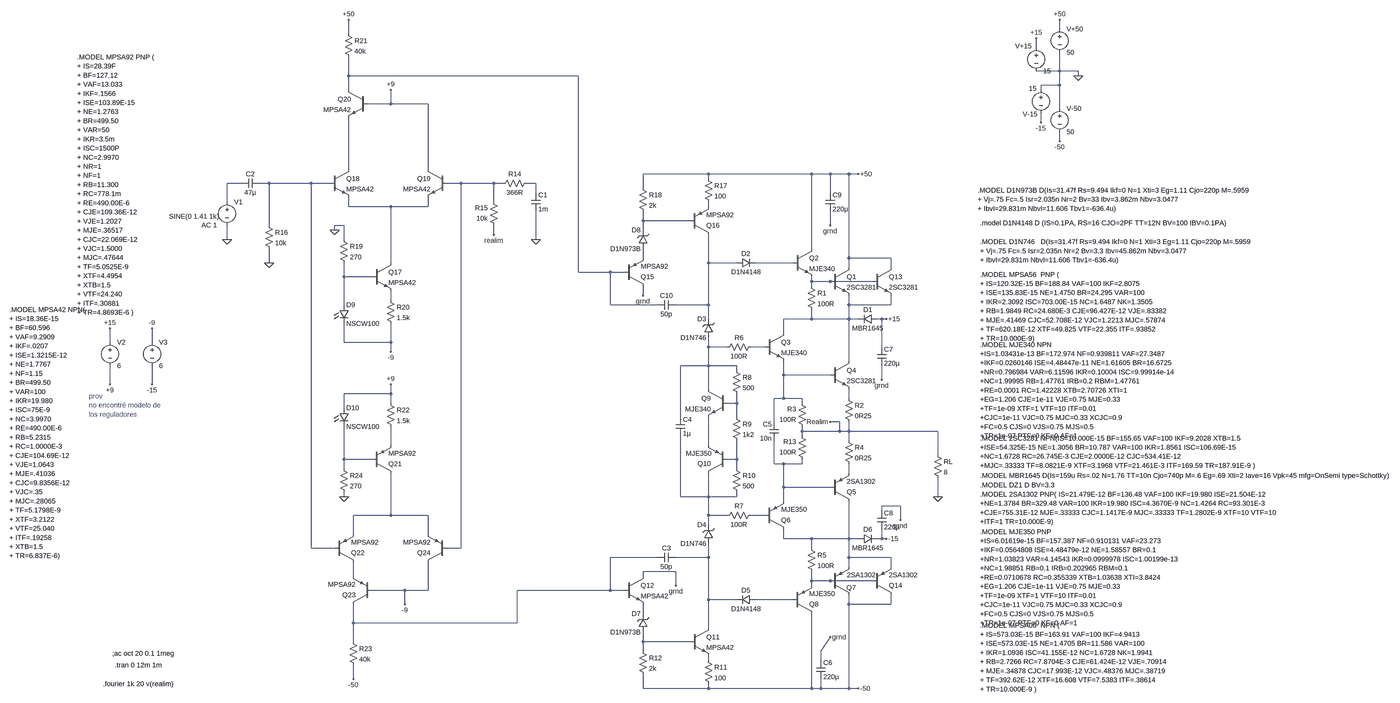
[diagram p0: schematic ampli_cascode_sinSS.asc, whole sheet]
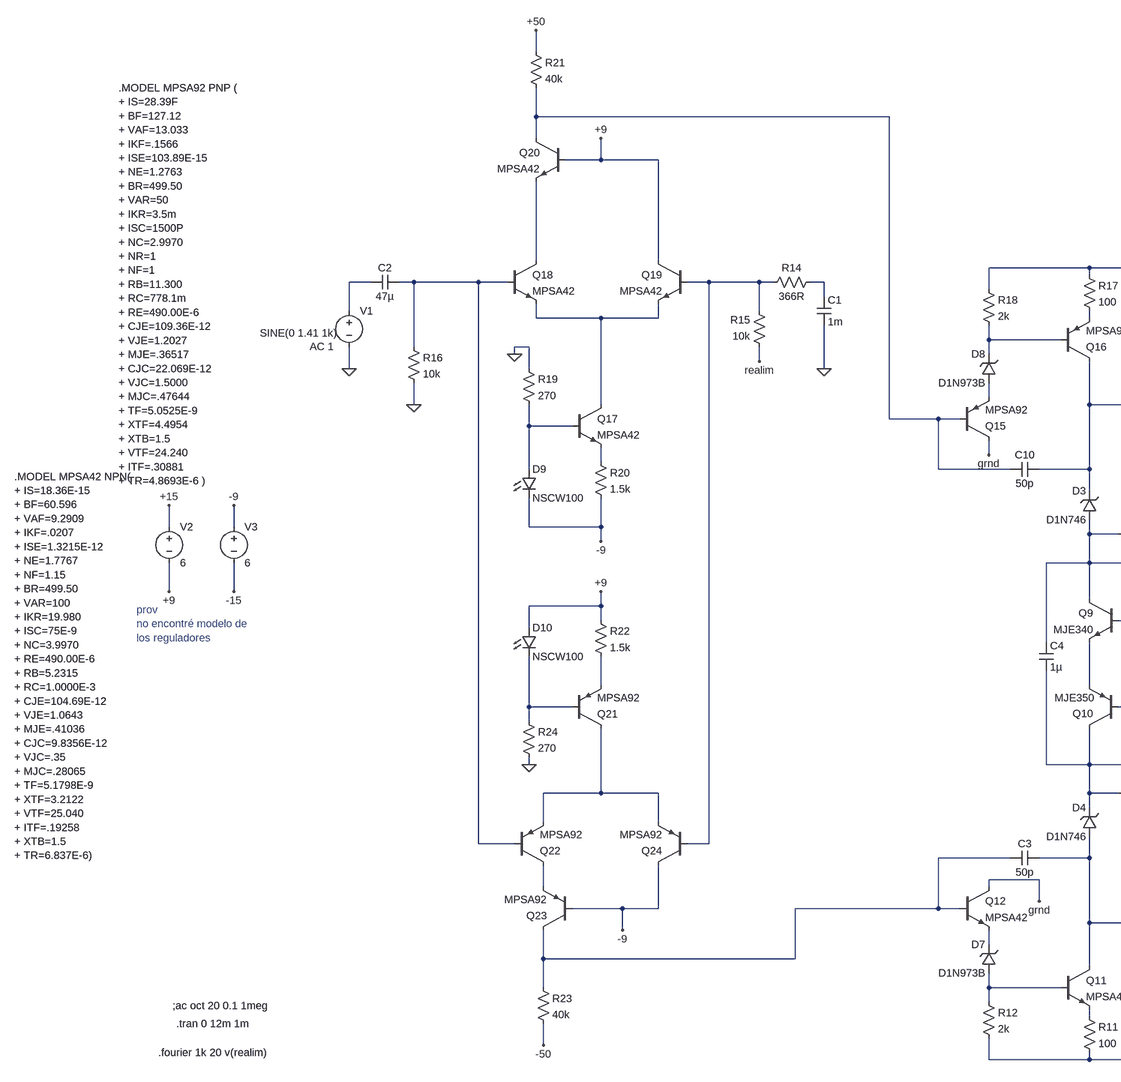
[diagram p1: schematic ampli_cascode_sinSS.asc, part, row 1 of 1, column 1 of 2]
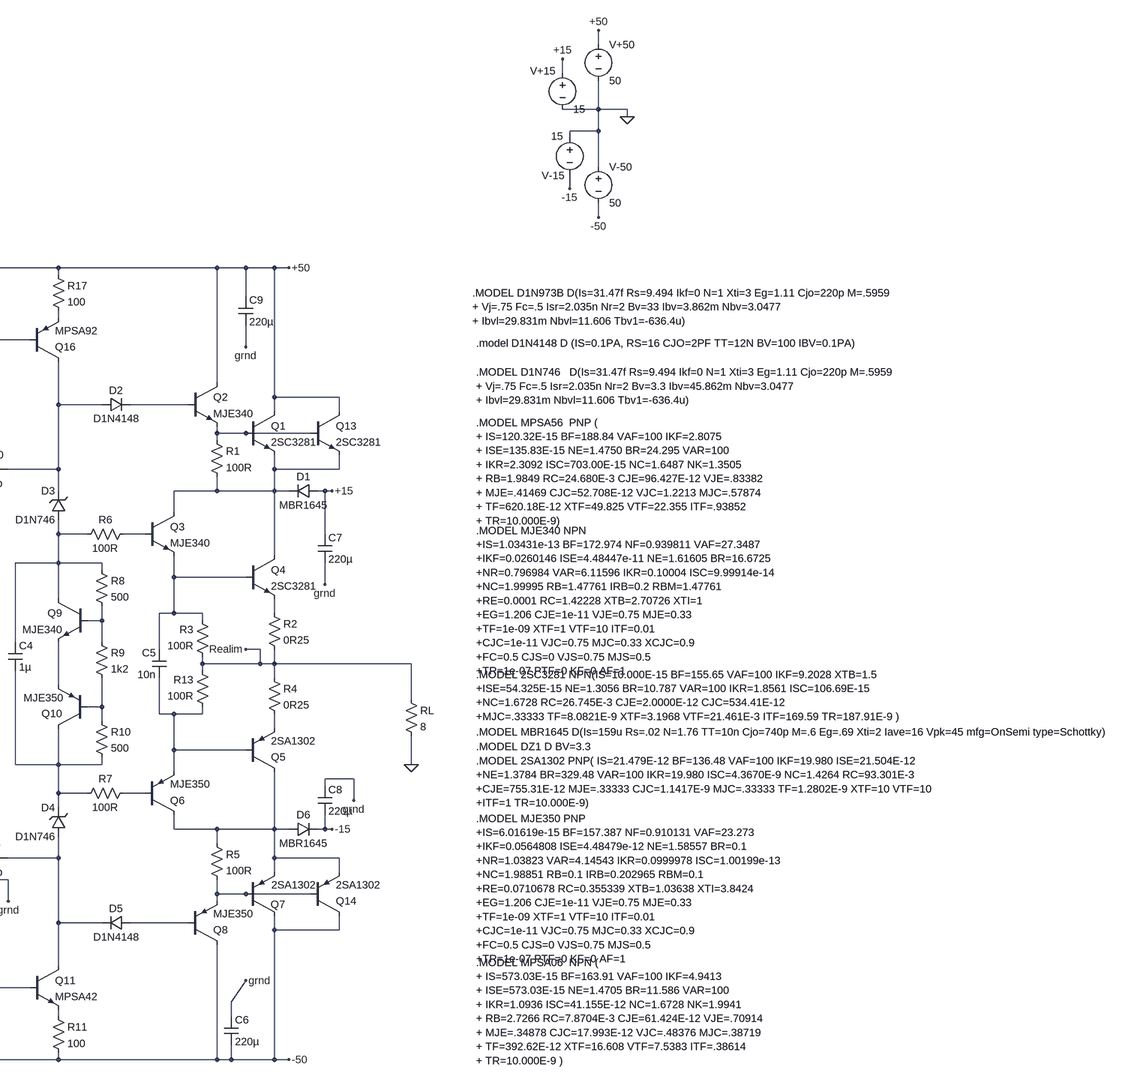
[diagram p2: schematic ampli_cascode_sinSS.asc, part, row 1 of 1, column 2 of 2]
ampli_cascode_sinSS.asc, the LTspice schematic file:
Version 4
SHEET 1 2432 4516
WIRE -576 -176 -576 -208
WIRE -3088 -160 -3088 -208
WIRE -656 -112 -656 -144
WIRE -576 -32 -576 -96
WIRE -576 -32 -656 -32
WIRE -512 -32 -576 -32
WIRE -3088 -16 -3088 -80
WIRE -2240 -16 -3088 -16
WIRE -512 -16 -512 -32
WIRE -576 16 -576 -32
WIRE -576 16 -640 16
WIRE -3088 32 -3088 -16
WIRE -640 32 -640 16
WIRE -2944 80 -2944 32
WIRE -2944 80 -3024 80
WIRE -2816 80 -2944 80
WIRE -576 96 -576 16
WIRE -640 144 -640 112
WIRE -576 208 -576 176
WIRE -3088 304 -3088 128
WIRE -2816 304 -2816 80
WIRE -1776 320 -2000 320
WIRE -1424 320 -1776 320
WIRE -1360 320 -1424 320
WIRE -1296 320 -1360 320
WIRE -1264 320 -1296 320
WIRE -1776 336 -1776 320
WIRE -3456 352 -3504 352
WIRE -3360 352 -3392 352
WIRE -3216 352 -3360 352
WIRE -3152 352 -3216 352
WIRE -2704 352 -2752 352
WIRE -2592 352 -2704 352
WIRE -2560 352 -2592 352
WIRE -2448 352 -2480 352
WIRE -2000 368 -2000 320
WIRE -2448 384 -2448 352
WIRE -1360 384 -1360 320
WIRE -3504 416 -3504 352
WIRE -2592 416 -2592 352
WIRE -3088 432 -3088 400
WIRE -2944 432 -3088 432
WIRE -2816 432 -2816 400
WIRE -2816 432 -2944 432
WIRE -1776 432 -1776 416
WIRE -2000 480 -2000 448
WIRE -1840 480 -2000 480
WIRE -3360 496 -3360 352
WIRE -3104 496 -3136 496
WIRE -1360 496 -1360 448
WIRE -3136 512 -3136 496
WIRE -2000 512 -2000 480
WIRE -2592 528 -2592 496
WIRE -3504 544 -3504 496
WIRE -3104 544 -3104 496
WIRE -2448 544 -2448 448
WIRE -1424 576 -1424 320
WIRE -2000 608 -2000 576
WIRE -1296 608 -1296 320
WIRE -1152 608 -1296 608
WIRE -3360 624 -3360 576
WIRE -2944 624 -2944 432
WIRE -1776 624 -1776 528
WIRE -1680 624 -1776 624
WIRE -1488 624 -1616 624
WIRE -1296 640 -1296 608
WIRE -1152 640 -1152 608
WIRE -2240 656 -2240 -16
WIRE -2112 656 -2240 656
WIRE -2064 656 -2112 656
WIRE -3104 672 -3104 624
WIRE -3008 672 -3104 672
WIRE -1424 688 -1424 672
WIRE -1360 688 -1424 688
WIRE -1216 688 -1360 688
WIRE -1424 704 -1424 688
WIRE -2000 736 -2000 704
WIRE -2944 752 -2944 720
WIRE -3104 768 -3104 672
WIRE -2112 768 -2112 656
WIRE -1952 768 -2112 768
WIRE -1776 768 -1776 624
WIRE -1776 768 -1888 768
WIRE -1296 768 -1296 736
WIRE -1152 768 -1152 736
WIRE -1152 768 -1296 768
WIRE -1776 816 -1776 768
WIRE -1424 816 -1424 784
WIRE -1424 816 -1520 816
WIRE -1296 816 -1296 768
WIRE -1296 816 -1424 816
WIRE -1264 816 -1296 816
WIRE -1184 816 -1200 816
WIRE -1168 816 -1184 816
WIRE -1520 864 -1520 816
WIRE -3904 896 -3904 848
WIRE -3760 896 -3760 848
WIRE -3104 896 -3104 832
WIRE -2944 896 -2944 832
WIRE -2944 896 -3104 896
WIRE -1776 912 -1776 880
WIRE -1712 912 -1776 912
WIRE -1584 912 -1632 912
WIRE -1184 912 -1184 816
WIRE -2944 928 -2944 896
WIRE -1296 960 -1296 816
WIRE -1776 976 -1776 912
WIRE -1776 976 -1872 976
WIRE -1680 976 -1776 976
WIRE -1680 992 -1680 976
WIRE -1520 1008 -1520 960
WIRE -1360 1008 -1520 1008
WIRE -1184 1024 -1184 976
WIRE -3904 1040 -3904 976
WIRE -3760 1040 -3760 976
WIRE -1776 1056 -1776 976
WIRE -2944 1072 -2944 1040
WIRE -2944 1072 -3104 1072
WIRE -1520 1088 -1520 1008
WIRE -1520 1088 -1552 1088
WIRE -1456 1088 -1520 1088
WIRE -1296 1088 -1296 1056
WIRE -2944 1104 -2944 1072
WIRE -1680 1104 -1680 1072
WIRE -1680 1104 -1712 1104
WIRE -1456 1104 -1456 1088
WIRE -3104 1120 -3104 1072
WIRE -1872 1152 -1872 976
WIRE -1680 1152 -1680 1104
WIRE -1552 1168 -1552 1088
WIRE -1328 1168 -1360 1168
WIRE -1456 1200 -1456 1184
WIRE -1328 1200 -1328 1168
WIRE -1328 1200 -1456 1200
WIRE -1296 1200 -1296 1168
WIRE -1296 1200 -1328 1200
WIRE -992 1200 -1296 1200
WIRE -1456 1216 -1456 1200
WIRE -1296 1232 -1296 1200
WIRE -2944 1248 -2944 1184
WIRE -1776 1248 -1776 1152
WIRE -992 1280 -992 1200
WIRE -3104 1296 -3104 1184
WIRE -3008 1296 -3104 1296
WIRE -1680 1296 -1680 1232
WIRE -1680 1296 -1712 1296
WIRE -1552 1312 -1552 1232
WIRE -1520 1312 -1552 1312
WIRE -1456 1312 -1456 1296
WIRE -1456 1312 -1520 1312
WIRE -3104 1328 -3104 1296
WIRE -1680 1328 -1680 1296
WIRE -1296 1344 -1296 1312
WIRE -1520 1392 -1520 1312
WIRE -1360 1392 -1520 1392
WIRE -3104 1424 -3104 1408
WIRE -1872 1424 -1872 1216
WIRE -1776 1424 -1776 1344
WIRE -1776 1424 -1872 1424
WIRE -1680 1424 -1680 1408
WIRE -1680 1424 -1776 1424
WIRE -992 1424 -992 1360
WIRE -1520 1440 -1520 1392
WIRE -1120 1456 -1184 1456
WIRE -1184 1472 -1184 1456
WIRE -2944 1488 -2944 1344
WIRE -2944 1488 -3072 1488
WIRE -2816 1488 -2944 1488
WIRE -1776 1488 -1776 1424
WIRE -1712 1488 -1776 1488
WIRE -1584 1488 -1632 1488
WIRE -1120 1504 -1120 1456
WIRE -1776 1520 -1776 1488
WIRE -3072 1552 -3072 1488
WIRE -2816 1552 -2816 1488
WIRE -1520 1568 -1520 1536
WIRE -1424 1568 -1520 1568
WIRE -1296 1568 -1296 1440
WIRE -1296 1568 -1424 1568
WIRE -1264 1568 -1296 1568
WIRE -1184 1568 -1184 1536
WIRE -1184 1568 -1200 1568
WIRE -1168 1568 -1184 1568
WIRE -3216 1600 -3216 352
WIRE -3136 1600 -3216 1600
WIRE -2704 1600 -2704 352
WIRE -2704 1600 -2752 1600
WIRE -1424 1600 -1424 1568
WIRE -1952 1632 -2112 1632
WIRE -1776 1632 -1776 1584
WIRE -1776 1632 -1888 1632
WIRE -1296 1632 -1296 1568
WIRE -1152 1632 -1296 1632
WIRE -1296 1664 -1296 1632
WIRE -1152 1664 -1152 1632
WIRE -1888 1680 -2000 1680
WIRE -3072 1696 -3072 1648
WIRE -2000 1696 -2000 1680
WIRE -1424 1712 -1424 1680
WIRE -1360 1712 -1424 1712
WIRE -1216 1712 -1360 1712
WIRE -1888 1728 -1888 1680
WIRE -1424 1728 -1424 1712
WIRE -2896 1744 -3008 1744
WIRE -2816 1744 -2816 1648
WIRE -2816 1744 -2896 1744
WIRE -2112 1744 -2112 1632
WIRE -2112 1744 -2512 1744
WIRE -2064 1744 -2112 1744
WIRE -1776 1776 -1776 1632
WIRE -1680 1776 -1776 1776
WIRE -1488 1776 -1616 1776
WIRE -2896 1792 -2896 1744
WIRE -1296 1792 -1296 1760
WIRE -1152 1792 -1152 1760
WIRE -1152 1792 -1296 1792
WIRE -2000 1824 -2000 1792
WIRE -3072 1856 -3072 1792
WIRE -2512 1856 -2512 1744
WIRE -2512 1856 -3072 1856
WIRE -1776 1872 -1776 1776
WIRE -3072 1920 -3072 1856
WIRE -2000 1920 -2000 1888
WIRE -1840 1920 -2000 1920
WIRE -2000 1952 -2000 1920
WIRE -1392 1952 -1360 1904
WIRE -1776 1984 -1776 1968
WIRE -1392 1984 -1392 1952
WIRE -3072 2048 -3072 2000
WIRE -2000 2080 -2000 2032
WIRE -1776 2080 -1776 2064
WIRE -1776 2080 -2000 2080
WIRE -1424 2080 -1424 1824
WIRE -1424 2080 -1776 2080
WIRE -1392 2080 -1392 2048
WIRE -1392 2080 -1424 2080
WIRE -1296 2080 -1296 1792
WIRE -1296 2080 -1392 2080
WIRE -1264 2080 -1296 2080
FLAG -512 -16 0
FLAG -576 -208 +50
FLAG -656 -144 +15
FLAG -640 144 -15
FLAG -576 208 -50
FLAG -1264 2080 -50
FLAG -1168 1568 -15
FLAG -1264 320 +50
FLAG -1168 816 +15
FLAG -2592 528 realim
FLAG -1360 1168 Realim
FLAG -1120 1504 grnd
FLAG -1184 1024 grnd
FLAG -1360 496 grnd
FLAG -1360 1904 grnd
FLAG -2000 736 grnd
FLAG -1888 1728 grnd
FLAG -3904 1040 +9
FLAG -3904 848 +15
FLAG -3760 848 -9
FLAG -3760 1040 -15
FLAG -2944 32 +9
FLAG -2944 928 -9
FLAG -3088 -208 +50
FLAG -2944 1040 +9
FLAG -2896 1792 -9
FLAG -3072 2048 -50
FLAG -3104 1424 0
FLAG -3136 512 0
FLAG -3360 624 0
FLAG -2448 544 0
FLAG -3504 544 0
FLAG -992 1424 0
SYMBOL rui\\shortcuts\\voltage -640 16 R0
WINDOW 0 -62 99 Left 2
WINDOW 3 -41 12 Left 2
WINDOW 123 0 0 Left 2
WINDOW 39 0 0 Left 2
SYMATTR InstName V-15
SYMATTR Value 15
SYMBOL rui\\shortcuts\\voltage -576 -192 R0
SYMATTR InstName V+50
SYMATTR Value 50
SYMBOL rui\\shortcuts\\voltage -656 -128 R0
WINDOW 0 -72 11 Left 2
SYMATTR InstName V+15
SYMATTR Value 15
SYMBOL rui\\shortcuts\\voltage -3504 400 R0
WINDOW 3 -198 65 Left 2
WINDOW 123 -87 95 Left 2
WINDOW 39 0 0 Left 2
SYMATTR Value SINE(0 1.41 1k)
SYMATTR Value2 AC 1
SYMATTR InstName V1
SYMBOL rui\\shortcuts\\voltage -576 80 R0
SYMATTR InstName V-50
SYMATTR Value 50
SYMBOL npn -1360 640 R0
SYMATTR InstName Q1
SYMATTR Value 2SC3281
SYMBOL npn -1488 576 R0
SYMATTR InstName Q2
SYMATTR Value MJE340
SYMBOL res -1440 688 R0
SYMATTR InstName R1
SYMATTR Value 100R
SYMBOL diode -1200 832 M270
WINDOW 0 32 32 VTop 2
WINDOW 3 0 32 VBottom 2
SYMATTR InstName D1
SYMATTR Value MBR1645
SYMBOL diode -1680 640 R270
WINDOW 0 32 32 VTop 2
WINDOW 3 0 32 VBottom 2
SYMATTR InstName D2
SYMATTR Value D1N4148
SYMBOL zener -1760 880 R180
WINDOW 0 24 64 Left 2
WINDOW 3 24 0 Left 2
SYMATTR InstName D3
SYMATTR Value D1N746
SYMBOL npn -1584 864 R0
SYMATTR InstName Q3
SYMATTR Value MJE340
SYMBOL npn -1360 960 R0
SYMATTR InstName Q4
SYMATTR Value 2SC3281
SYMBOL res -1312 1072 R0
SYMATTR InstName R2
SYMATTR Value 0R25
SYMBOL res -1440 1200 R180
WINDOW 0 36 76 Left 2
WINDOW 3 36 40 Left 2
SYMATTR InstName R3
SYMATTR Value 100R
SYMBOL res -1312 1216 R0
SYMATTR InstName R4
SYMATTR Value 0R25
SYMBOL pnp -1360 1440 M180
SYMATTR InstName Q5
SYMATTR Value 2SA1302
SYMBOL pnp -1584 1536 M180
SYMATTR InstName Q6
SYMATTR Value MJE350
SYMBOL pnp -1360 1760 M180
WINDOW 0 55 25 Left 2
WINDOW 3 57 68 Left 2
SYMATTR InstName Q7
SYMATTR Value 2SA1302
SYMBOL pnp -1488 1824 M180
SYMATTR InstName Q8
SYMATTR Value MJE350
SYMBOL res -1440 1584 R0
SYMATTR InstName R5
SYMATTR Value 100R
SYMBOL zener -1760 1584 R180
WINDOW 0 24 64 Left 2
WINDOW 3 24 0 Left 2
SYMATTR InstName D4
SYMATTR Value D1N746
SYMBOL diode -1616 1760 R90
WINDOW 0 0 32 VBottom 2
WINDOW 3 32 32 VTop 2
SYMATTR InstName D5
SYMATTR Value D1N4148
SYMBOL diode -1264 1584 R270
WINDOW 0 32 32 VTop 2
WINDOW 3 0 32 VBottom 2
SYMATTR InstName D6
SYMATTR Value MBR1645
SYMBOL res -1616 896 R90
WINDOW 0 0 56 VBottom 2
WINDOW 3 32 56 VTop 2
SYMATTR InstName R6
SYMATTR Value 100R
SYMBOL res -1616 1472 R90
WINDOW 0 0 56 VBottom 2
WINDOW 3 32 56 VTop 2
SYMATTR InstName R7
SYMATTR Value 100R
SYMBOL npn -1712 1056 M0
SYMATTR InstName Q9
SYMATTR Value MJE340
SYMBOL pnp -1712 1344 R180
WINDOW 0 56 33 Left 2
WINDOW 3 53 68 Left 2
SYMATTR InstName Q10
SYMATTR Value MJE350
SYMBOL res -1696 976 R0
SYMATTR InstName R8
SYMATTR Value 500
SYMBOL res -1696 1136 R0
SYMATTR InstName R9
SYMATTR Value 1k2
SYMBOL res -1696 1312 R0
SYMATTR InstName R10
SYMATTR Value 500
SYMBOL npn -1840 1872 R0
SYMATTR InstName Q11
SYMATTR Value MPSA42
SYMBOL res -1792 1968 R0
SYMATTR InstName R11
SYMATTR Value 100
SYMBOL npn -2064 1696 R0
SYMATTR InstName Q12
SYMATTR Value MPSA42
SYMBOL res -2016 1936 R0
SYMATTR InstName R12
SYMATTR Value 2k
SYMBOL res -1440 1312 R180
WINDOW 0 36 76 Left 2
WINDOW 3 36 40 Left 2
SYMATTR InstName R13
SYMATTR Value 100R
SYMBOL res -2576 368 R270
WINDOW 0 32 56 VTop 2
WINDOW 3 0 56 VBottom 2
SYMATTR InstName R14
SYMATTR Value 366R
SYMBOL res -2576 512 R180
WINDOW 0 36 76 Left 2
WINDOW 3 36 40 Left 2
SYMATTR InstName R15
SYMATTR Value 10k
SYMBOL res -3376 480 R0
SYMATTR InstName R16
SYMATTR Value 10k
SYMBOL cap -2464 384 R0
SYMATTR InstName C1
SYMATTR Value 1m
SYMBOL cap -3392 336 R90
WINDOW 0 0 32 VBottom 2
WINDOW 3 32 32 VTop 2
SYMATTR InstName C2
SYMATTR Value 47µ
SYMBOL cap -1888 1616 R90
WINDOW 0 0 32 VBottom 2
WINDOW 3 32 32 VTop 2
SYMATTR InstName C3
SYMATTR Value 50p
SYMBOL cap -1888 1152 R0
SYMATTR InstName C4
SYMATTR Value 1µ
SYMBOL cap -1536 1232 R180
WINDOW 0 24 56 Left 2
WINDOW 3 24 8 Left 2
SYMATTR InstName C5
SYMATTR Value 10n
SYMBOL npn -1216 640 R0
SYMATTR InstName Q13
SYMATTR Value 2SC3281
SYMBOL pnp -1216 1760 M180
SYMATTR InstName Q14
SYMATTR Value 2SA1302
SYMBOL cap -1408 1984 R0
SYMATTR InstName C6
SYMATTR Value 220µ
SYMBOL cap -1200 912 R0
SYMATTR InstName C7
SYMATTR Value 220µ
SYMBOL cap -1200 1472 R0
SYMATTR InstName C8
SYMATTR Value 220µ
SYMBOL cap -1376 384 R0
SYMATTR InstName C9
SYMATTR Value 220µ
SYMBOL pnp -2064 704 M180
SYMATTR InstName Q15
SYMATTR Value MPSA92
SYMBOL pnp -1840 528 M180
SYMATTR InstName Q16
SYMATTR Value MPSA92
SYMBOL cap -1888 752 R90
WINDOW 0 0 32 VBottom 2
WINDOW 3 32 32 VTop 2
SYMATTR InstName C10
SYMATTR Value 50p
SYMBOL res -1792 320 R0
SYMATTR InstName R17
SYMATTR Value 100
SYMBOL res -2016 352 R0
SYMATTR InstName R18
SYMATTR Value 2k
SYMBOL zener -1984 1888 R180
WINDOW 0 24 64 Left 2
WINDOW 3 24 0 Left 2
SYMATTR InstName D7
SYMATTR Value D1N973B
SYMBOL zener -1984 576 R180
WINDOW 0 24 64 Left 2
WINDOW 3 24 0 Left 2
SYMATTR InstName D8
SYMATTR Value D1N973B
SYMBOL rui\\shortcuts\\voltage -3904 880 R0
WINDOW 123 0 0 Left 2
WINDOW 39 0 0 Left 2
SYMATTR InstName V2
SYMATTR Value 6
SYMBOL rui\\shortcuts\\voltage -3760 880 R0
WINDOW 123 0 0 Left 2
WINDOW 39 0 0 Left 2
SYMATTR InstName V3
SYMATTR Value 6
SYMBOL npn -3008 624 R0
SYMATTR InstName Q17
SYMATTR Value MPSA42
SYMBOL npn -3152 304 R0
SYMATTR InstName Q18
SYMATTR Value MPSA42
SYMBOL npn -2752 304 M0
SYMATTR InstName Q19
SYMATTR Value MPSA42
SYMBOL res -3120 528 R0
SYMATTR InstName R19
SYMATTR Value 270
SYMBOL res -2960 736 R0
SYMATTR InstName R20
SYMATTR Value 1.5k
SYMBOL LED -3120 768 R0
SYMATTR InstName D9
SYMATTR Value NSCW100
SYMBOL res -3104 -176 R0
SYMATTR InstName R21
SYMATTR Value 40k
SYMBOL npn -3024 32 M0
SYMATTR InstName Q20
SYMATTR Value MPSA42
SYMBOL res -2960 1088 R0
SYMATTR InstName R22
SYMATTR Value 1.5k
SYMBOL rui\\shortcuts\\pnp -3008 1344 M180
SYMATTR InstName Q21
SYMATTR Value MPSA92
SYMBOL rui\\shortcuts\\pnp -3136 1648 M180
SYMATTR InstName Q22
SYMATTR Value MPSA92
SYMBOL rui\\shortcuts\\pnp -3008 1792 R180
SYMATTR InstName Q23
SYMATTR Value MPSA92
SYMBOL res -3088 1904 R0
SYMATTR InstName R23
SYMATTR Value 40k
SYMBOL rui\\shortcuts\\pnp -2752 1648 R180
SYMATTR InstName Q24
SYMATTR Value MPSA92
SYMBOL LED -3120 1120 R0
SYMATTR InstName D10
SYMATTR Value NSCW100
SYMBOL res -3120 1312 R0
SYMATTR InstName R24
SYMATTR Value 270
SYMBOL res -1008 1264 R0
SYMATTR InstName RL
SYMATTR Value 8
TEXT -3888 2000 Left 2 !.tran 0 12m 1m
TEXT -3976 1080 Left 2 ;prov\nno encontré modelo de\nlos reguladores
TEXT -4016 -80 Left 2 !.MODEL MPSA92 PNP (\n+ IS=28.39F\n+ BF=127.12\n+ VAF=13.033\n+ IKF=.1566\n+ ISE=103.89E-15\n+ NE=1.2763\n+ BR=499.50\n+ VAR=50\n+ IKR=3.5m\n+ ISC=1500P\n+ NC=2.9970\n+ NR=1\n+ NF=1\n+ RB=11.300\n+ RC=778.1m\n+ RE=490.00E-6\n+ CJE=109.36E-12\n+ VJE=1.2027\n+ MJE=.36517\n+ CJC=22.069E-12\n+ VJC=1.5000\n+ MJC=.47644\n+ TF=5.0525E-9\n+ XTF=4.4954\n+ XTB=1.5\n+ VTF=24.240\n+ ITF=.30881\n+ TR=4.8693E-6 )
TEXT -4248 784 Left 2 !.MODEL MPSA42 NPN(\n+ IS=18.36E-15\n+ BF=60.596\n+ VAF=9.2909\n+ IKF=.0207\n+ ISE=1.3215E-12\n+ NE=1.7767\n+ NF=1.15\n+ BR=499.50\n+ VAR=100\n+ IKR=19.980\n+ ISC=75E-9\n+ NC=3.9970\n+ RE=490.00E-6\n+ RB=5.2315\n+ RC=1.0000E-3\n+ CJE=104.69E-12\n+ VJE=1.0643\n+ MJE=.41036\n+ CJC=9.8356E-12\n+ VJC=.35\n+ MJC=.28065\n+ TF=5.1798E-9\n+ XTF=3.2122\n+ VTF=25.040\n+ ITF=.19258\n+ XTB=1.5\n+ TR=6.837E-6)
TEXT -3896 1960 Left 2 !;ac oct 20 0.1 1meg
TEXT -848 1384 Left 2 !.MODEL DZ1 D BV=3.3
TEXT -848 664 Left 2 !.MODEL MPSA56  PNP (\n+ IS=120.32E-15 BF=188.84 VAF=100 IKF=2.8075\n+ ISE=135.83E-15 NE=1.4750 BR=24.295 VAR=100\n+ IKR=2.3092 ISC=703.00E-15 NC=1.6487 NK=1.3505\n+ RB=1.9849 RC=24.680E-3 CJE=96.427E-12 VJE=.83382\n+ MJE=.41469 CJC=52.708E-12 VJC=1.2213 MJC=.57874\n+ TF=620.18E-12 XTF=49.825 VTF=22.355 ITF=.93852\n+ TR=10.000E-9)
TEXT -848 904 Left 2 !.MODEL MJE340 NPN\n+IS=1.03431e-13 BF=172.974 NF=0.939811 VAF=27.3487\n+IKF=0.0260146 ISE=4.48447e-11 NE=1.61605 BR=16.6725\n+NR=0.796984 VAR=6.11596 IKR=0.10004 ISC=9.99914e-14\n+NC=1.99995 RB=1.47761 IRB=0.2 RBM=1.47761\n+RE=0.0001 RC=1.42228 XTB=2.70726 XTI=1\n+EG=1.206 CJE=1e-11 VJE=0.75 MJE=0.33\n+TF=1e-09 XTF=1 VTF=10 ITF=0.01\n+CJC=1e-11 VJC=0.75 MJC=0.33 XCJC=0.9\n+FC=0.5 CJS=0 VJS=0.75 MJS=0.5\n+TR=1e-07 PTF=0 KF=0 AF=1
TEXT -848 1224 Left 2 !.MODEL 2SC3281 NPN(IS=10.000E-15 BF=155.65 VAF=100 IKF=9.2028 XTB=1.5\n+ISE=54.325E-15 NE=1.3056 BR=10.787 VAR=100 IKR=1.8561 ISC=106.69E-15\n+NC=1.6728 RC=26.745E-3 CJE=2.0000E-12 CJC=534.41E-12\n+MJC=.33333 TF=8.0821E-9 XTF=3.1968 VTF=21.461E-3 ITF=169.59 TR=187.91E-9 )
TEXT -848 1352 Left 2 !.MODEL MBR1645 D(Is=159u Rs=.02 N=1.76 TT=10n Cjo=740p M=.6 Eg=.69 Xti=2 Iave=16 Vpk=45 mfg=OnSemi type=Schottky)
TEXT -848 1416 Left 2 !.MODEL 2SA1302 PNP( IS=21.479E-12 BF=136.48 VAF=100 IKF=19.980 ISE=21.504E-12\n+NE=1.3784 BR=329.48 VAR=100 IKR=19.980 ISC=4.3670E-9 NC=1.4264 RC=93.301E-3\n+CJE=755.31E-12 MJE=.33333 CJC=1.1417E-9 MJC=.33333 TF=1.2802E-9 XTF=10 VTF=10\n+ITF=1 TR=10.000E-9)
TEXT -848 1544 Left 2 !.MODEL MJE350 PNP\n+IS=6.01619e-15 BF=157.387 NF=0.910131 VAF=23.273\n+IKF=0.0564808 ISE=4.48479e-12 NE=1.58557 BR=0.1\n+NR=1.03823 VAR=4.14543 IKR=0.0999978 ISC=1.00199e-13\n+NC=1.98851 RB=0.1 IRB=0.202965 RBM=0.1\n+RE=0.0710678 RC=0.355339 XTB=1.03638 XTI=3.8424\n+EG=1.206 CJE=1e-11 VJE=0.75 MJE=0.33\n+TF=1e-09 XTF=1 VTF=10 ITF=0.01\n+CJC=1e-11 VJC=0.75 MJC=0.33 XCJC=0.9\n+FC=0.5 CJS=0 VJS=0.75 MJS=0.5\n+TR=1e-07 PTF=0 KF=0 AF=1
TEXT -848 1864 Left 2 !.MODEL MPSA06  NPN (\n+ IS=573.03E-15 BF=163.91 VAF=100 IKF=4.9413\n+ ISE=573.03E-15 NE=1.4705 BR=11.586 VAR=100\n+ IKR=1.0936 ISC=41.155E-12 NC=1.6728 NK=1.9941\n+ RB=2.7266 RC=7.8704E-3 CJE=61.424E-12 VJE=.70914\n+ MJE=.34878 CJC=17.993E-12 VJC=.48376 MJC=.38719\n+ TF=392.62E-12 XTF=16.608 VTF=7.5383 ITF=.38614\n+ TR=10.000E-9 )
TEXT -848 552 Left 2 !.MODEL D1N746   D(Is=31.47f Rs=9.494 Ikf=0 N=1 Xti=3 Eg=1.11 Cjo=220p M=.5959\n+ Vj=.75 Fc=.5 Isr=2.035n Nr=2 Bv=3.3 Ibv=45.862m Nbv=3.0477\n+ Ibvl=29.831m Nbvl=11.606 Tbv1=-636.4u)
TEXT -848 488 Left 2 !.model D1N4148 D (IS=0.1PA, RS=16 CJO=2PF TT=12N BV=100 IBV=0.1PA)
TEXT -856 376 Left 2 !.MODEL D1N973B D(Is=31.47f Rs=9.494 Ikf=0 N=1 Xti=3 Eg=1.11 Cjo=220p M=.5959\n+ Vj=.75 Fc=.5 Isr=2.035n Nr=2 Bv=33 Ibv=3.862m Nbv=3.0477\n+ Ibvl=29.831m Nbvl=11.606 Tbv1=-636.4u)
TEXT -3928 2064 Left 2 !.fourier 1k 20 v(realim)

The netlist it stands for:
* ampli_cascode_sinSS.asc
V-15 0 -15 15
V+50 +50 0 50
V+15 +15 0 15
V1 N003 0 SINE(0 1.41 1k) AC 1
V-50 0 -50 50
Q1 +50 N014 N016 0 2SC3281
Q2 +50 N012 N014 0 MJE340
R1 N014 N016 100R
D1 +15 N016 MBR1645
D2 N011 N012 D1N4148
D3 N017 N011 D1N746
Q3 N016 N018 N019 0 MJE340
Q4 N016 N019 N020 0 2SC3281
R2 N020 realim 0R25
R3 realim N019 100R
R4 realim N027 0R25
Q5 N031 N026 N027 0 2SA1302
Q6 N031 N030 N026 0 MJE350
Q7 -50 N035 N031 0 2SA1302
Q8 -50 N036 N035 0 MJE350
R5 N031 N035 100R
D4 N033 N028 D1N746
D5 N036 N033 D1N4148
D6 N031 -15 MBR1645
R6 N018 N017 100R
R7 N030 N028 100R
Q9 N017 N021 N023 0 MJE340
Q10 N028 N025 N023 0 MJE350
R8 N017 N021 500
R9 N021 N025 1k2
R10 N025 N028 500
Q11 N033 N038 N039 0 MPSA42
R11 N039 -50 100
Q12 grnd N032 N037 0 MPSA42
R12 N038 -50 2k
R13 N026 realim 100R
R14 N005 N006 366R
R15 realim N005 10k
R16 N004 0 10k
C1 N006 0 1m
C2 N004 N003 47µ
C3 N033 N032 50p
C4 N017 N028 1µ
C5 N026 N019 10n
Q13 +50 N014 N016 0 2SC3281
Q14 -50 N035 N031 0 2SA1302
C6 grnd -50 220µ
C7 +15 grnd 220µ
C8 grnd -15 220µ
C9 +50 grnd 220µ
Q15 grnd N001 N010 0 MPSA92
Q16 N011 N009 N008 0 MPSA92
C10 N011 N001 50p
R17 +50 N008 100
R18 +50 N009 2k
D7 N038 N037 D1N973B
D8 N010 N009 D1N973B
V2 +15 +9 6
V3 -9 -15 6
Q17 N007 N013 N015 0 MPSA42
Q18 N002 N004 N007 0 MPSA42
Q19 +9 N005 N007 0 MPSA42
R19 0 N013 270
R20 N015 -9 1.5k
D9 N013 -9 NSCW100
R21 +50 N001 40k
Q20 N001 +9 N002 0 MPSA42
R22 +9 N022 1.5k
Q21 N029 N024 N022 0 MPSA92
Q22 N034 N004 N029 0 MPSA92
Q23 N032 -9 N034 0 MPSA92
R23 N032 -50 40k
Q24 -9 N005 N029 0 MPSA92
D10 +9 N024 NSCW100
R24 N024 0 270
RL realim 0 8
.model D D
.lib standard.dio
.model NPN NPN
.model PNP PNP
.lib standard.bjt
.tran 0 12m 1m
* prov
* no encontré modelo de
* los reguladores
.MODEL MPSA92 PNP (
+ IS=28.39F
+ BF=127.12
+ VAF=13.033
+ IKF=.1566
+ ISE=103.89E-15
+ NE=1.2763
+ BR=499.50
+ VAR=50
+ IKR=3.5m
+ ISC=1500P
+ NC=2.9970
+ NR=1
+ NF=1
+ RB=11.300
+ RC=778.1m
+ RE=490.00E-6
+ CJE=109.36E-12
+ VJE=1.2027
+ MJE=.36517
+ CJC=22.069E-12
+ VJC=1.5000
+ MJC=.47644
+ TF=5.0525E-9
+ XTF=4.4954
+ XTB=1.5
+ VTF=24.240
+ ITF=.30881
+ TR=4.8693E-6 )
.MODEL MPSA42 NPN(
+ IS=18.36E-15
+ BF=60.596
+ VAF=9.2909
+ IKF=.0207
+ ISE=1.3215E-12
+ NE=1.7767
+ NF=1.15
+ BR=499.50
+ VAR=100
+ IKR=19.980
+ ISC=75E-9
+ NC=3.9970
+ RE=490.00E-6
+ RB=5.2315
+ RC=1.0000E-3
+ CJE=104.69E-12
+ VJE=1.0643
+ MJE=.41036
+ CJC=9.8356E-12
+ VJC=.35
+ MJC=.28065
+ TF=5.1798E-9
+ XTF=3.2122
+ VTF=25.040
+ ITF=.19258
+ XTB=1.5
+ TR=6.837E-6)
;ac oct 20 0.1 1meg
.MODEL DZ1 D BV=3.3
.MODEL MPSA56  PNP (
+ IS=120.32E-15 BF=188.84 VAF=100 IKF=2.8075
+ ISE=135.83E-15 NE=1.4750 BR=24.295 VAR=100
+ IKR=2.3092 ISC=703.00E-15 NC=1.6487 NK=1.3505
+ RB=1.9849 RC=24.680E-3 CJE=96.427E-12 VJE=.83382
+ MJE=.41469 CJC=52.708E-12 VJC=1.2213 MJC=.57874
+ TF=620.18E-12 XTF=49.825 VTF=22.355 ITF=.93852
+ TR=10.000E-9)
.MODEL MJE340 NPN
+IS=1.03431e-13 BF=172.974 NF=0.939811 VAF=27.3487
+IKF=0.0260146 ISE=4.48447e-11 NE=1.61605 BR=16.6725
+NR=0.796984 VAR=6.11596 IKR=0.10004 ISC=9.99914e-14
+NC=1.99995 RB=1.47761 IRB=0.2 RBM=1.47761
+RE=0.0001 RC=1.42228 XTB=2.70726 XTI=1
+EG=1.206 CJE=1e-11 VJE=0.75 MJE=0.33
+TF=1e-09 XTF=1 VTF=10 ITF=0.01
+CJC=1e-11 VJC=0.75 MJC=0.33 XCJC=0.9
+FC=0.5 CJS=0 VJS=0.75 MJS=0.5
+TR=1e-07 PTF=0 KF=0 AF=1
.MODEL 2SC3281 NPN(IS=10.000E-15 BF=155.65 VAF=100 IKF=9.2028 XTB=1.5
+ISE=54.325E-15 NE=1.3056 BR=10.787 VAR=100 IKR=1.8561 ISC=106.69E-15
+NC=1.6728 RC=26.745E-3 CJE=2.0000E-12 CJC=534.41E-12
+MJC=.33333 TF=8.0821E-9 XTF=3.1968 VTF=21.461E-3 ITF=169.59 TR=187.91E-9 )
.MODEL MBR1645 D(Is=159u Rs=.02 N=1.76 TT=10n Cjo=740p M=.6 Eg=.69 Xti=2 Iave=16 Vpk=45 mfg=OnSemi type=Schottky)
.MODEL 2SA1302 PNP( IS=21.479E-12 BF=136.48 VAF=100 IKF=19.980 ISE=21.504E-12
+NE=1.3784 BR=329.48 VAR=100 IKR=19.980 ISC=4.3670E-9 NC=1.4264 RC=93.301E-3
+CJE=755.31E-12 MJE=.33333 CJC=1.1417E-9 MJC=.33333 TF=1.2802E-9 XTF=10 VTF=10
+ITF=1 TR=10.000E-9)
.MODEL MJE350 PNP
+IS=6.01619e-15 BF=157.387 NF=0.910131 VAF=23.273
+IKF=0.0564808 ISE=4.48479e-12 NE=1.58557 BR=0.1
+NR=1.03823 VAR=4.14543 IKR=0.0999978 ISC=1.00199e-13
+NC=1.98851 RB=0.1 IRB=0.202965 RBM=0.1
+RE=0.0710678 RC=0.355339 XTB=1.03638 XTI=3.8424
+EG=1.206 CJE=1e-11 VJE=0.75 MJE=0.33
+TF=1e-09 XTF=1 VTF=10 ITF=0.01
+CJC=1e-11 VJC=0.75 MJC=0.33 XCJC=0.9
+FC=0.5 CJS=0 VJS=0.75 MJS=0.5
+TR=1e-07 PTF=0 KF=0 AF=1
.MODEL MPSA06  NPN (
+ IS=573.03E-15 BF=163.91 VAF=100 IKF=4.9413
+ ISE=573.03E-15 NE=1.4705 BR=11.586 VAR=100
+ IKR=1.0936 ISC=41.155E-12 NC=1.6728 NK=1.9941
+ RB=2.7266 RC=7.8704E-3 CJE=61.424E-12 VJE=.70914
+ MJE=.34878 CJC=17.993E-12 VJC=.48376 MJC=.38719
+ TF=392.62E-12 XTF=16.608 VTF=7.5383 ITF=.38614
+ TR=10.000E-9 )
.MODEL D1N746   D(Is=31.47f Rs=9.494 Ikf=0 N=1 Xti=3 Eg=1.11 Cjo=220p M=.5959
+ Vj=.75 Fc=.5 Isr=2.035n Nr=2 Bv=3.3 Ibv=45.862m Nbv=3.0477
+ Ibvl=29.831m Nbvl=11.606 Tbv1=-636.4u)
.model D1N4148 D (IS=0.1PA, RS=16 CJO=2PF TT=12N BV=100 IBV=0.1PA)
.MODEL D1N973B D(Is=31.47f Rs=9.494 Ikf=0 N=1 Xti=3 Eg=1.11 Cjo=220p M=.5959
+ Vj=.75 Fc=.5 Isr=2.035n Nr=2 Bv=33 Ibv=3.862m Nbv=3.0477
+ Ibvl=29.831m Nbvl=11.606 Tbv1=-636.4u)
.fourier 1k 20 v(realim)
.backanno
.end